# Altium project GaN_Driver.PrjPcb
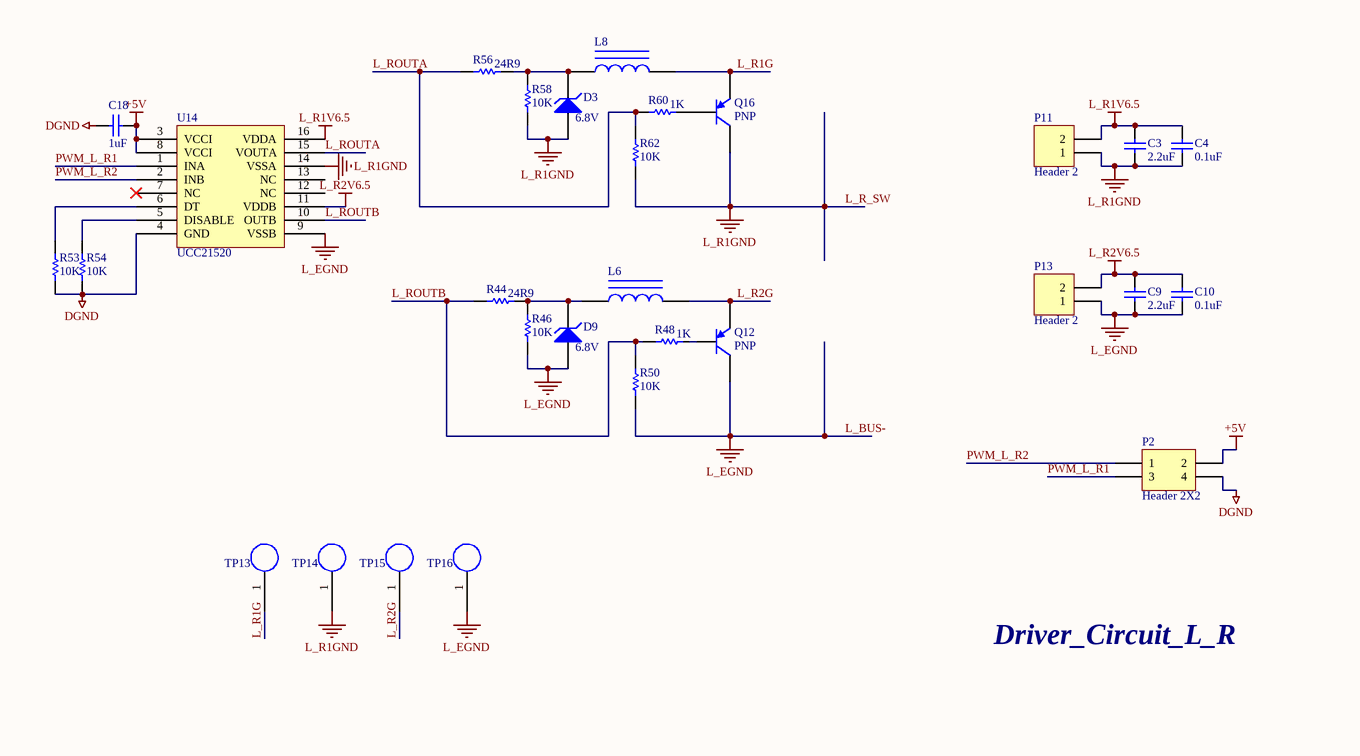
[diagram p0: GaN_Driver.SchDoc, left]
1 sheet, 29 parts. Net scope: global (net labels, ports and power ports of the same name join across sheets).
Board file: GaN_Driver.PcbDoc

## Sheet GaN_Driver.SchDoc
size A4

### Parts
C3  2.2uF  [0603_C]
C4  0.1uF  [0603_C]
C9  2.2uF  [0603_C]
C10  0.1uF  [0603_C]
C18  1uF  [0603_C]
D3  6.8V  [SOD323]
D9  6.8V  [SOD323]
L6  Inductor Iron  [0603_R]  (value not drawn)
L8  Inductor Iron  [0603_R]  (value not drawn)
P2  Header 2X2  [HDR2X2]
P11  Header 2  [HDR1X2]
P13  Header 2  [HDR1X2]
Q12  PNP  [SOT-23 (NPN/PNP)]
Q16  PNP  [SOT-23 (NPN/PNP)]
R44  24R9  [0603_R]
R46  10K  [0603_R]
R48  1k  [0603_R]
R50  10K  [0603_R]
R53  10K  [0603_R]
R54  10K  [0603_R]
R56  24R9  [0603_R]
R58  10K  [0603_R]
R60  1k  [0603_R]
R62  10K  [0603_R]
TP13  Test_Point  [Test_Point]  (value not drawn)
TP14  Test_Point  [Test_Point]  (value not drawn)
TP15  Test_Point  [Test_Point]  (value not drawn)
TP16  Test_Point  [Test_Point]  (value not drawn)
U14  UCC21520  [SOIC-16W]

### Nets
+5V: C18.1 P2.2 U14.3(VCCI) U14.8(VCCI)
DGND: C18.2 P2.4 R53.1 R54.1 U14.4(GND)
L_BUS-: C9.2 C10.2 D9.1(A) P13.1 Q12.1(C) R46.1 R50.1 TP16.1 U14.9(VSSB)  [also labelled L_EGND]
L_R1V6.5: C3.1 C4.1 P11.2 U14.16(VDDA)
L_R2V6.5: C9.1 C10.1 P13.2 U14.11(VDDB)
L_R_SW: C3.2 C4.2 D3.1(A) P11.1 Q16.1(C) R58.1 R62.1 TP14.1 U14.14(VSSA)  [also labelled L_R1GND]
L_R1G: L8.2 Q16.3(E) TP13.1
L_R2G: L6.2 Q12.3(E) TP15.1
L_ROUTA: R56.1 R60.1 R62.2 U14.15(VOUTA)
L_ROUTB: R44.1 R48.1 R50.2 U14.10(OUTB)
PWM_L_R1: P2.3 U14.1(INA)
PWM_L_R2: P2.1 U14.2(INB)
NetD3_2: D3.2(K) L8.1 R56.2 R58.2
NetD9_2: D9.2(K) L6.1 R44.2 R46.2
NetQ12_2: Q12.2(B) R48.2
NetQ16_2: Q16.2(B) R60.2
NetR53_2: R53.2 U14.6(DT)
NetR54_2: R54.2 U14.5(DISABLE)

Not connected (* = marked no-connect by the designer): U14 7(NC)* 12(NC) 13(NC)

### Notes on the sheet
- Driver_Circuit_L_R

### Library data of the parts
C3 C4 C9 C10 C18 = Cap: Capacitor; Manufacturer: Generic Components; Class: Passive; Value: 100pF; Published: 08/06/2000; Publisher: Altium Hobart Technology Centre; SubClass: Capacitor
D3 D9 = D Zener: Zener Diode; Published: 8-Jun-2000; LatestRevisionDate: 17-Jul-2002; LatestRevisionNote: Re-released for DXP Platform.; PackageReference: DIODE-0.7; Publisher: Altium Limited
L6 L8 = Inductor Iron: Magnetic-Core Inductor; Value: 10mH; Published: 24-Mar-1999; LatestRevisionDate: 17-Jul-2002; LatestRevisionNote: Re-released for DXP Platform.; PackageReference: 0603_R; Publisher: Altium Limited
P2 = Header 2X2: Header, 2-Pin, Dual row; LatestRevisionDate: 17-Jul-2002; LatestRevisionNote: Re-released for DXP Platform.; Publisher: Altium Limited
P11 P13 = Header 2: Header, 2-Pin; LatestRevisionDate: 17-Jul-2002; LatestRevisionNote: Re-released for DXP Platform.; Publisher: Altium Limited
Q12 Q16 = PNP: PNP Bipolar Transistor; Published: 8-Jun-2000; LatestRevisionDate: 17-Jul-2002; LatestRevisionNote: Re-released for DXP Platform.; PackageReference: SOT-23B; Publisher: Altium Limited; Code_JEDEC: SOT-23
R44 R46 R48 R50 R53 R54 R56 R58 R60 R62 = Res Semi: Semiconductor Resistor; Published: 8-Jun-2000; LatestRevisionDate: 17-Jul-2002; LatestRevisionNote: Re-released for DXP Platform.; PackageReference: AXIAL-0.5; Publisher: Altium Limited
  R44 R56: Value: 24R9
  R46 R50 R53 R54 R58 R62: Value: 10K
  R48 R60: Value: 1K